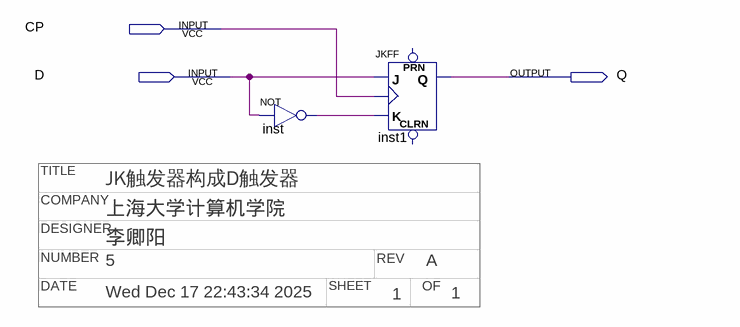
[diagram p0: schematic sheet]
// Quartus schematic sikao3.bdf as structural Verilog: 2 symbols, 3 pins
// Title block: TITLE: JK触发器构成D触发器; COMPANY: 上海大学计算机学院; DESIGNER: 李卿阳; NUMBER: 5; REV: A; DATE: Wed Dec 17 22:43:34 2025; SHEET: 1; OF: 1
module sikao3 (
  input  CP,
  input  D,
  output Q
);

  wire inst_out;

  not inst (inst_out, D);
  JKFF inst1 (.K(inst_out), .J(D), .CLK(CP), .Q(Q));  // open: PRN, CLRN
endmodule
